# EAGLE schematic expand (EAGLE 5.10)
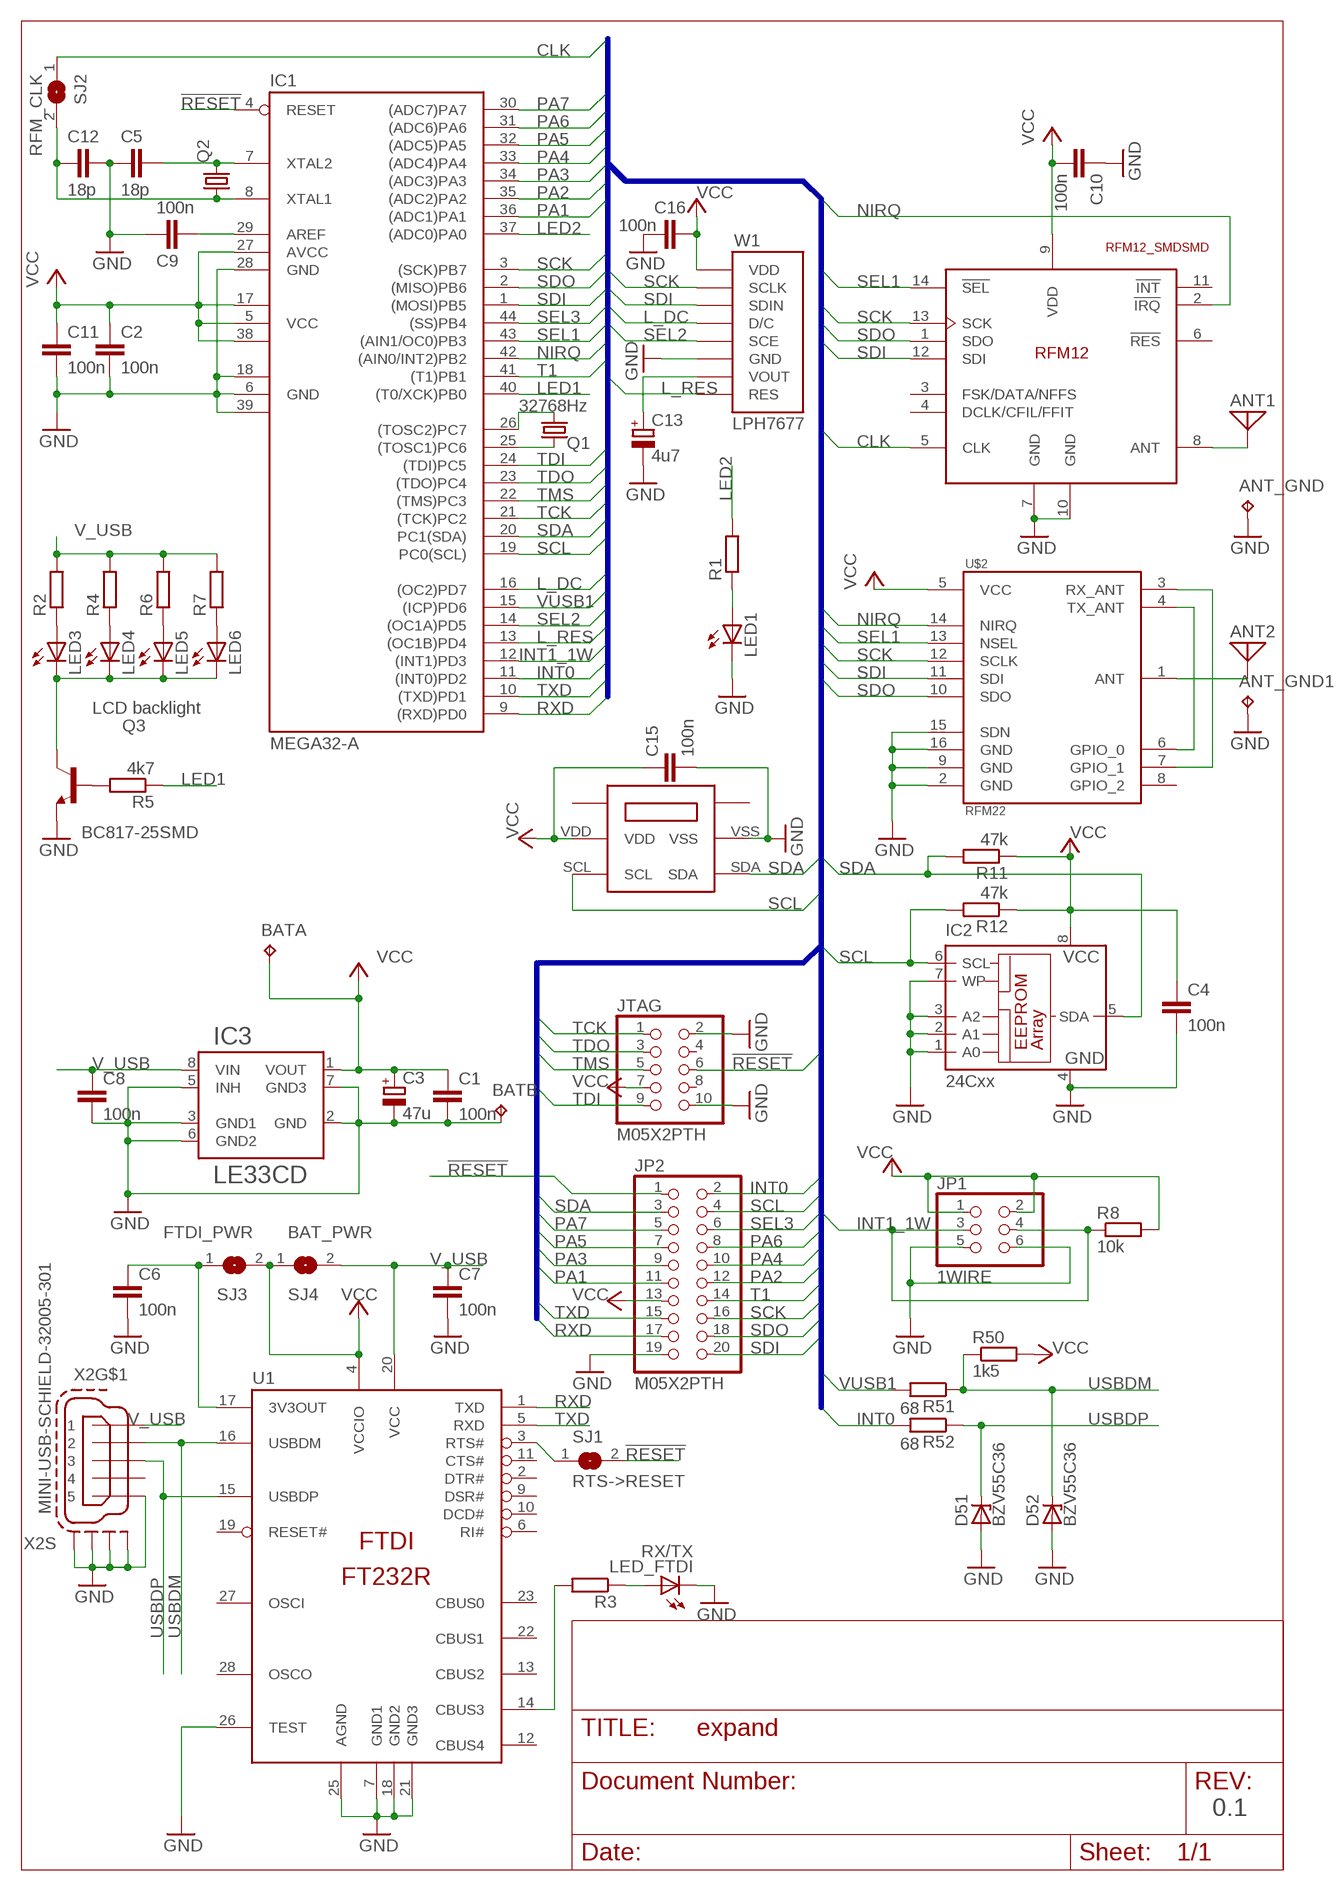
[diagram p0: schematic, sheet 1]

## Parts
ANT1  ANT  [PAD-01]
ANT2  ANT  [PAD-01]
ANT_GND  TPTP20SQ  [TP20SQ]
ANT_GND1  TPTP20SQ  [TP20SQ]
BAT  TP2P2-38-17  [P2-38-17]
C1  100n  C-EUC0603  [C0603]
C2  100n  C-EUC0603  [C0603]
C3  47u  CPOL-EUSMCD  [SMC_D]
C4  100n  C-EUC0603  [C0603]
C5  18p  C-EUC0603  [C0603]
C6  100n  C-EUC0603  [C0603]
C7  100n  C-EUC0603  [C0603]
C8  100n  C-EUC0603  [C0603]
C9  100n  C-EUC0603  [C0603]
C10  100n  C-EUC0603  [C0603]
C11  100n  C-EUC0603  [C0603]
C12  18p  C-EUC0603  [C0603]
C13  4u7  CPOL-EUSMCA  [SMC_A]
C15  100n  C-EUC0603  [C0603]
C16  100n  C-EUC0603  [C0603]
D51  BZV55C36  ZENER-DIODESOD80C  [SOD80C]
D52  BZV55C36  ZENER-DIODESOD80C  [SOD80C]
IC1  MEGA32-A  [TQFP44]
IC2  24Cxx  24C01ASM  [SO-08M]
IC3  LE33CD  LEXX  [SO08]
JP1  1WIRE  PINHD-2X3  [2X03]
JP2  M05X2PTH  PINHD-2X10  [2X10]
JTAG  M05X2PTH  PINHD-2X5  [2X05]
LED1  LEDCHIPLED_0805  [CHIPLED_0805]
LED3  LEDCHIPLED_0805  [CHIPLED_0805]
LED4  LEDCHIPLED_0805  [CHIPLED_0805]
LED5  LEDCHIPLED_0805  [CHIPLED_0805]
LED6  LEDCHIPLED_0805  [CHIPLED_0805]
LED_FTDI  RX/TX  LEDCHIPLED_0805  [CHIPLED_0805]
Q1  32768Hz  CRYSTALTC26V  [TC26V]
Q2  CRYSTALHC49U-V  [HC49U-V]
Q3  BC817-25SMD  [SOT23-BEC]
R1  R-EU_R0603  [R0603]
R2  R-EU_R0603  [R0603]
R3  R-EU_R0603  [R0603]
R4  R-EU_R0603  [R0603]
R5  4k7  R-EU_R0603  [R0603]
R6  R-EU_R0603  [R0603]
R7  R-EU_R0603  [R0603]
R8  10k  R-EU_R0603  [R0603]
R11  47k  R-EU_R0603  [R0603]
R12  47k  R-EU_R0603  [R0603]
R50  1k5  R-EU_R0603  [R0603]
R51  68  R-EU_R0603  [R0603]
R52  68  R-EU_R0603  [R0603]
SJ1  RTS->RESET  SJ  [SJ]
SJ2  RFM_CLK  SJ  [SJ]
SJ3  FTDI_PWR  SJ  [SJ]
SJ4  BAT_PWR  SJ  [SJ]
U1  FT232RL  [SSOP28DB]
U$1  RFM12_SMDSMD  [RFM12]
U$2  RFM22  [RFM22-XXX-S2]
U$3  SHT21  [SHT21]
W1  LPH7677  [LPH7677]
X2  MINI-USB-SCHIELD-32005-301  [32005-301]

## Nets
!RESET: IC1.4(RESET) JP2.1 JTAG.6 SJ1.2
CLK: SJ2.1 U$1.5(CLK)
GND: ANT_GND1.TP ANT_GND.TP BAT.TP-2 C1.2 C2.2 C3.- C4.2 C5.2 C6.2 C7.2 C8.2 C9.1 C10.1 C11.2 C12.1 C13.- C15.2 C16.2 D51.A D52.A IC1.6(GND) IC1.18(GND1) IC1.28(GND) IC1.39(GND2) IC2.1(A0) IC2.2(A1) IC2.3(A2) IC2.4(GND) IC2.7(WP) IC3.2(GND) IC3.3(GND1) IC3.5(INH) IC3.6(GND2) IC3.7(GND3) JP1.5 JP1.6 JP2.19 JTAG.2 JTAG.10 LED1.C LED_FTDI.C Q3.E U1.7(GND1) U1.18(GND2) U1.21(GND3) U1.25(AGND) U1.26(TEST) U$1.7(GND) U$1.10(GND) U$2.2(GND) U$2.9(GND) U$2.15(SDN) U$2.16(GND) U$3.VSS W1.6GND(GND) X2.5 X2.M1(S:S1) X2.M2(S:S2) X2.M3(S:S3) X2.M4(S:S4)
INT0: IC1.11((INT0)PD2) JP2.2 R52.2
INT1_1W: IC1.12((INT1)PD3) JP1.3 JP1.4 R8.1
L_DC: IC1.16((OC2)PD7) W1.4D/C(D/C)
L_RES: IC1.13((OC1B)PD4) W1.8RES(RES)
LED1: IC1.40((T0/XCK)PB0) R5.1
LED2: IC1.37((ADC0)PA0) R1.2
N$1: LED3.A R2.1
N$2: Q3.B R5.2
N$3: LED4.A R4.1
N$4: LED5.A R6.1
N$5: U$2.4(TX_ANT) U$2.6(GPIO_0)
N$6: C6.1 SJ3.1 U1.17(3V3OUT)
N$10: LED_FTDI.A R3.1
N$11: R3.2 U1.14(CBUS3)
N$12: LED1.A R1.1
N$14: SJ1.1 U1.3(RTS#)
N$15: C9.2 IC1.29(AREF)
N$16: U$2.3(RX_ANT) U$2.7(GPIO_1)
N$17: ANT1.1(TP) U$1.8(ANT)
N$18: IC1.25((TOSC1)PC6) Q1.1
N$19: LED6.A R7.1
N$20: IC1.26((TOSC2)PC7) Q1.2
N$21: LED3.C LED4.C LED5.C LED6.C Q3.C
N$22: C13.+ W1.7VOUT(VOUT)
N$24: C5.1 IC1.7(XTAL2) Q2.2
N$25: ANT2.1(TP) U$2.1(ANT)
N$26: C12.2 IC1.8(XTAL1) Q2.1 SJ2.2
NIRQ: IC1.42((AIN0/INT2)PB2) U$1.2(!IRQ) U$2.14(NIRQ)
PA1: IC1.36((ADC1)PA1) JP2.11
PA2: IC1.35((ADC2)PA2) JP2.12
PA3: IC1.34((ADC3)PA3) JP2.9
PA4: IC1.33((ADC4)PA4) JP2.10
PA5: IC1.32((ADC5)PA5) JP2.7
PA6: IC1.31((ADC6)PA6) JP2.8
PA7: IC1.30((ADC7)PA7) JP2.5
RXD: IC1.9((RXD)PD0) JP2.17 U1.1(TXD)
SCK: IC1.3((SCK)PB7) JP2.16 U$1.13(SCK) U$2.12(SCLK) W1.2SCLK(SCLK)
SCL: IC1.19(PC0(SCL)) IC2.6(SCL) JP2.4 R12.2 U$3.SCL
SDA: IC1.20(PC1(SDA)) IC2.5(SDA) JP2.3 R11.2 U$3.SDA
SDI: IC1.1((MOSI)PB5) JP2.20 U$1.12(SDI) U$2.11(SDI) W1.3SDIN(SDIN)
SDO: IC1.2((MISO)PB6) JP2.18 U$1.1(SDO) U$2.10(SDO)
SEL1: IC1.43((AIN1/OC0)PB3) U$1.14(!SEL) U$2.13(NSEL)
SEL2: IC1.14((OC1A)PD5) W1.5SCE(SCE)
SEL3: IC1.44((SS)PB4) JP2.6
T1: IC1.41((T1)PB1) JP2.14
TCK: IC1.21((TCK)PC2) JTAG.1
TDI: IC1.24((TDI)PC5) JTAG.9
TDO: IC1.23((TDO)PC4) JTAG.3
TMS: IC1.22((TMS)PC3) JTAG.5
TXD: IC1.10((TXD)PD1) JP2.15 U1.5(RXD)
USBDM: D52.C R50.1 R51.1 U1.16(USBDM) X2.2
USBDP: D51.C R52.1 U1.15(USBDP) X2.3
V_USB: C7.1 C8.1 IC3.8(VIN) R2.2 R4.2 R6.2 R7.2 SJ4.2 U1.20(VCC) X2.1
VCC: BAT.TP-1 C1.1 C2.1 C3.+ C4.1 C10.2 C11.1 C15.1 C16.1 IC1.5(VCC) IC1.17(VCC1) IC1.27(AVCC) IC1.38(VCC2) IC2.8(VCC) IC3.1(VOUT) JP1.1 JP1.2 JP2.13 JTAG.7 R8.2 R11.1 R12.1 R50.2 SJ3.2 SJ4.1 U1.4(VCCIO) U$1.9(VDD) U$2.5(VCC) U$3.VDD W1.1VDD(VDD)
VUSB1: IC1.15((ICP)PD6) R51.2
Unconnected: JTAG.4 JTAG.8 U1.2(DTR#) U1.6(RI#) U1.9(DSR#) U1.10(DCD#) U1.11(CTS#) U1.12(CBUS4) U1.13(CBUS2) U1.19(RESET#) U1.22(CBUS1) U1.23(CBUS0) U1.27(OSCI) U1.28(OSCO) U$1.3(FSK/DATA/NFFS) U$1.4(DCLK/CFIL/FFIT) U$1.6(!RES) U$1.11(!INT) U$2.8(GPIO_2) U$3.NC1(NC2) U$3.NC2(NC) X2.4

## Buses
IO:!RESET,TMS,TCK,TDO,TXD,RXD,TDI,SDA,SCL,SCK,SDO,SDI,SEL1,SEL2,SEL3,NIRQ,L_RES,PA7,PA6,PA5,PA4,PA3,PA2,PA1,PA0,L_DC,CLK,INT1_1W,PD4,PD5,PD6,INT0,RXD,TXD,PB0,INT2,VUSB1,T1

## Notes on the sheet
- LCD backlight
- 0.1

## Library data of the parts
ANT1 ANT2 = OpenHR20_master:ANT
ANT_GND ANT_GND1 = testpad:TP: Test pad
BAT = testpad:TP2: Test pad
C1 C2 C4-C12 C15 C16 = resistor:C-EU: CAPACITOR, European symbol
C3 = resistor:CPOL-EU: POLARIZED CAPACITOR, European symbol
C13 = rcl:CPOL-EU: POLARIZED CAPACITOR, European symbol
D51 D52 = diode:ZENER-DIODE: Z-Diode
IC1 = atmel:MEGA32: MICROCONTROLLER 32 Kbytes FLASH 2 Kbytes SRAM 1 Kbytes EEPROM USART 8-channel 10 bit ADC Source: www.atmel.com .. doc2503.pdf
IC2 = microchip:24*: Serial EEPROM I2C
IC3 = lexxab:LEXX: Very low drop voltage regulator with inhibit (LE25, LE33, etc.)
JP1 = pinhead:PINHD-2X3: PIN HEADER
JP2 = pinhead:PINHD-2X10: PIN HEADER
JTAG = pinhead:PINHD-2X5: PIN HEADER
LED1 LED3-LED6 LED_FTDI = led:LED: LED OSRAM: - CHIPLED LG R971, LG N971, LY N971, LG Q971, LY Q971, LO R971, LY R971 LH N974, LH R974 LS Q976, LO Q976, LY Q976 LO Q996 - Hyper CHIPLED LW Q18S LB Q993, LB Q99A, LB R99A - SideLED LS A670, LO A670, LY A670, LG A670, LP A670 LB A673, LV A673, LT A673, LW A673 LH A674 LY A675 LS A676, LA A676, LO A676, LY A676, LW A676 LS A679, LY A679, LG A679 - Hyper Micro SIDELED® LS Y876, LA Y876, LO Y876, LY Y876 LT Y87S - SmartLED LW L88C, LW L88S LB L89C, LB L89S, LG L890 LS L89K, LO L89K, LY L89K LS L896, LA L896, LO L896, LY L896 - TOPLED LS T670, LO T670, LY T670, LG T670, LP T670 LSG T670, LSP T670, LSY T670, LOP T670, LYG T670 LG T671, LOG T671, LSG T671 LB T673, LV T673, LT T673, LW T673 LH T674 LS T676, LA T676, LO T676, LY T676, LB T676, LH T676, LSB T676, LW T676 LB T67C, LV T67C, LT T67C, LS T67K, LO T67K, LY T67K, LW E67C LS E67B, LA E67B, LO E67B, LY E67B, LB E67C, LV E67C, LT E67C LW T67C LS T679, LY T679, LG T679 LS T770, LO T770, LY T770, LG T770, LP T770 LB T773, LV T773, LT T773, LW T773 LH T774 LS E675, LA E675, LY E675, LS T675 LS T776, LA T776, LO T776, LY T776, LB T776 LHGB T686 LT T68C, LB T68C - Hyper Mini TOPLED® LB M676 - Mini TOPLED Santana® LG M470 LS M47K, LO M47K, LY M47K Source: http://www.osram.convergy.de LUXEON: - LUMILED® LXK2-PW12-R00, LXK2-PW12-S00, LXK2-PW14-U00, LXK2-PW14-V00 LXK2-PM12-R00, LXK2-PM12-S00, LXK2-PM14-U00 LXK2-PE12-Q00, LXK2-PE12-R00, LXK2-PE12-S00, LXK2-PE14-T00, LXK2-PE14-U00 LXK2-PB12-K00, LXK2-PB12-L00, LXK2-PB12-M00, LXK2-PB14-N00, LXK2-PB14-P00, LXK2-PB14-Q00 LXK2-PR12-L00, LXK2-PR12-M00, LXK2-PR14-Q00, LXK2-PR14-R00 LXK2-PD12-Q00, LXK2-PD12-R00, LXK2-PD12-S00 LXK2-PH12-R00, LXK2-PH12-S00 LXK2-PL12-P00, LXK2-PL12-Q00, LXK2-PL12-R00 Source: www.luxeon.com KINGBRIGHT: KA-3528ASYC Source: www.kingbright.com
Q1 Q2 = crystal:CRYSTAL: CRYSTAL
Q3 = transistor-npn:BC817*: NPN Transistor
R1-R8 R11 R12 R50-R52 = resistor:R-EU_: RESISTOR, European symbol
SJ1-SJ4 = jumper:SJ: SMD solder JUMPER
U1 = ftdichip-3:FT232RL: USB UART 4th Generation USB UART (USB <-> Serial) Controller
U$1 = rfm_12:RFM12_SMD: RFM12 is a low costing ISM band transceiver module implemented with unique PLL. It works signal ranges from 315/433/868/915MHZ bands, comply with FCC, ETSI regulation. The SPI interface is used to communicate with microcontroller for parameter setting.
U$2 = SparkFun:RFM22: *Hope RF's RFM22* Packages: RFM22-S2 (SMD)
U$3 = sht21:SHT21
W1 = lcd_n3200_lph7677:LPH7677: LPH7677 Nokia 3210 displayer.
X2 = con-cypressindustries:MINI-USB-SCHIELD-: MINI USB-B Conector Source: www.cypressindustries.com